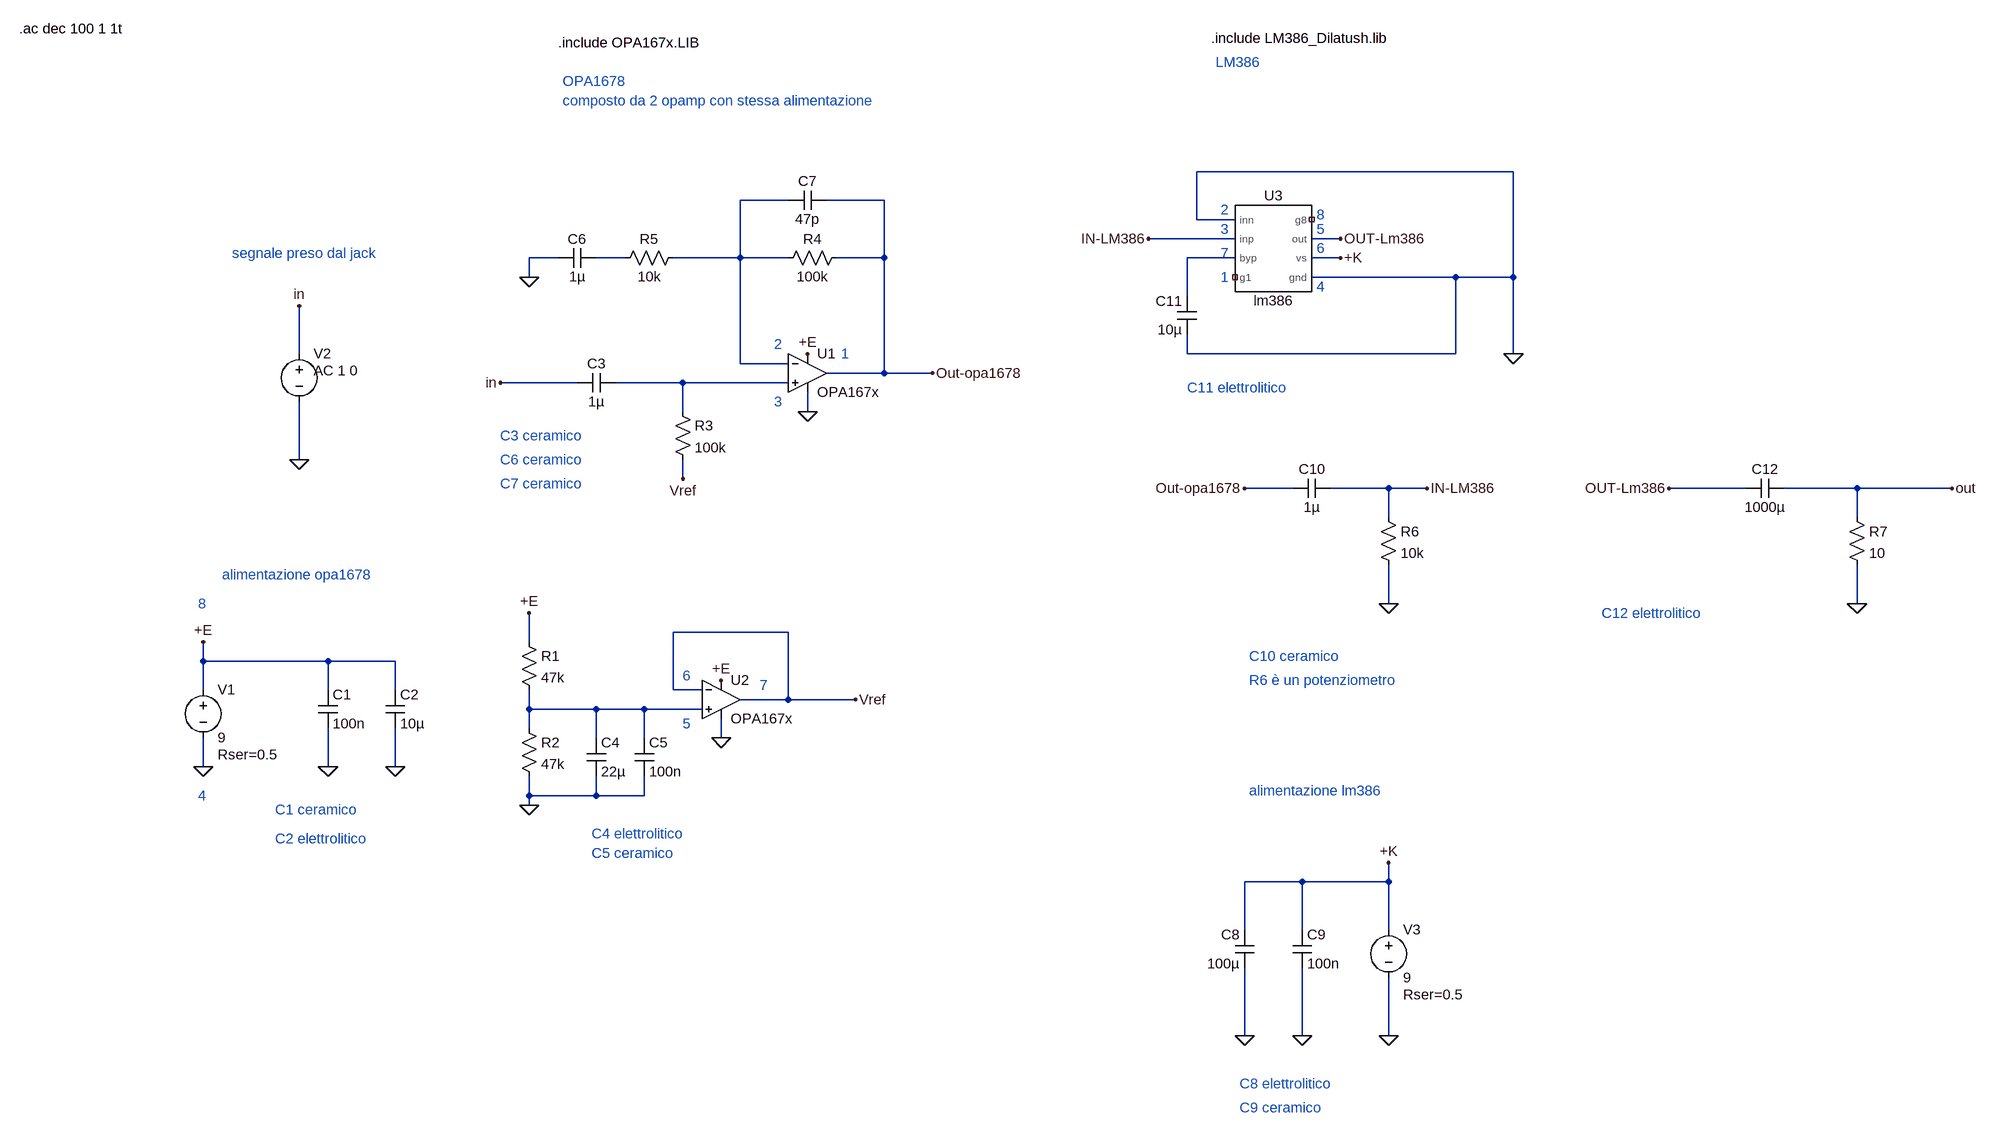
[diagram p0: schematic Test-schematico.asc]
Test-schematico.asc, the LTspice schematic file:
Version 4.1
SHEET 1 2776 920
WIRE 1648 -656 1120 -656
WIRE 48 -608 -32 -608
WIRE 208 -608 112 -608
WIRE 1120 -576 1120 -656
WIRE 1184 -576 1120 -576
WIRE 1184 -544 1040 -544
WIRE 1360 -544 1312 -544
WIRE -336 -512 -384 -512
WIRE -224 -512 -272 -512
WIRE -32 -512 -32 -608
WIRE -32 -512 -144 -512
WIRE 48 -512 -32 -512
WIRE 208 -512 208 -608
WIRE 208 -512 128 -512
WIRE 1184 -512 1104 -512
WIRE 1360 -512 1312 -512
WIRE -384 -480 -384 -512
WIRE 1552 -480 1312 -480
WIRE 1648 -480 1648 -656
WIRE 1648 -480 1552 -480
WIRE 1104 -448 1104 -512
WIRE -1024 -352 -1024 -432
WIRE 1104 -352 1104 -384
WIRE 1552 -352 1552 -480
WIRE 1552 -352 1104 -352
WIRE 1648 -352 1648 -480
WIRE -32 -336 -32 -512
WIRE 48 -336 -32 -336
WIRE 208 -320 208 -512
WIRE 208 -320 112 -320
WIRE 288 -320 208 -320
WIRE -304 -304 -432 -304
WIRE -128 -304 -240 -304
WIRE 48 -304 -128 -304
WIRE -128 -256 -128 -304
WIRE 80 -256 80 -288
WIRE -1024 -176 -1024 -272
WIRE -128 -144 -128 -176
WIRE 1280 -128 1200 -128
WIRE 1440 -128 1344 -128
WIRE 1504 -128 1440 -128
WIRE 2112 -128 1984 -128
WIRE 2304 -128 2176 -128
WIRE 2464 -128 2304 -128
WIRE 1440 -80 1440 -128
WIRE 2304 -80 2304 -128
WIRE 1440 64 1440 0
WIRE 2304 64 2304 0
WIRE 48 112 -144 112
WIRE -384 128 -384 80
WIRE -1184 160 -1184 128
WIRE -976 160 -1184 160
WIRE -864 160 -976 160
WIRE -1184 208 -1184 160
WIRE -976 208 -976 160
WIRE -864 208 -864 160
WIRE -144 208 -144 112
WIRE -96 208 -144 208
WIRE 48 224 48 112
WIRE 48 224 -32 224
WIRE 160 224 48 224
WIRE -384 240 -384 208
WIRE -272 240 -384 240
WIRE -192 240 -272 240
WIRE -96 240 -192 240
WIRE -384 272 -384 240
WIRE -272 288 -272 240
WIRE -192 288 -192 240
WIRE -64 288 -64 256
WIRE -1184 336 -1184 288
WIRE -976 336 -976 272
WIRE -864 336 -864 272
WIRE -384 384 -384 352
WIRE -272 384 -272 352
WIRE -272 384 -384 384
WIRE -192 384 -192 352
WIRE -192 384 -272 384
WIRE -384 400 -384 384
WIRE 1296 528 1200 528
WIRE 1440 528 1440 496
WIRE 1440 528 1296 528
WIRE 1200 608 1200 528
WIRE 1296 608 1296 528
WIRE 1440 608 1440 528
WIRE 1200 784 1200 672
WIRE 1296 784 1296 672
WIRE 1440 784 1440 688
FLAG -1184 336 0
FLAG -1184 128 +E
FLAG 80 -256 0
FLAG -64 288 0
FLAG -976 336 0
FLAG -864 336 0
FLAG -64 192 +E
FLAG 80 -352 +E
FLAG 160 224 Vref
FLAG -128 -144 Vref
FLAG -384 400 0
FLAG -384 80 +E
FLAG -1024 -176 0
FLAG -1024 -432 in
FLAG -384 -480 0
FLAG 288 -320 Out-opa1678
FLAG -432 -304 in
FLAG 1440 784 0
FLAG 1200 784 0
FLAG 1296 784 0
FLAG 1440 496 +K
FLAG 1440 64 0
FLAG 1200 -128 Out-opa1678
FLAG 1504 -128 IN-LM386
FLAG 1040 -544 IN-LM386
FLAG 1648 -352 0
FLAG 1360 -544 OUT-Lm386
FLAG 1360 -512 +K
FLAG 2304 64 0
FLAG 1984 -128 OUT-Lm386
FLAG 2464 -128 out
SYMBOL OpAmps\\opamp2 80 -384 R0
SYMATTR InstName U1
SYMATTR Value OPA167x
SYMBOL OpAmps\\opamp2 -64 160 R0
SYMATTR InstName U2
SYMATTR Value OPA167x
SYMBOL voltage -1184 192 R0
WINDOW 123 0 0 Left 0
WINDOW 39 24 124 Left 2
SYMATTR SpiceLine Rser=0.5
SYMATTR InstName V1
SYMATTR Value 9
SYMBOL cap -992 208 R0
SYMATTR InstName C1
SYMATTR Value 100n
SYMATTR SpiceLine V=50 Irms=20.8m Rser=5.448 Lser=0
SYMBOL cap -880 208 R0
SYMATTR Value 10µ
SYMATTR InstName C2
SYMATTR SpiceLine V=16 Irms=0 Rser=2.8 Lser=0 mfg="AVX" pn="TAJC106M016" type="Tantalum"
SYMBOL res -144 -272 R0
SYMATTR InstName R3
SYMATTR Value 100k
SYMBOL res -400 112 R0
SYMATTR InstName R1
SYMATTR Value 47k
SYMBOL res -400 256 R0
SYMATTR InstName R2
SYMATTR Value 47k
SYMBOL cap -288 288 R0
SYMATTR InstName C4
SYMATTR Value 22µ
SYMBOL cap -208 288 R0
SYMATTR InstName C5
SYMATTR Value 100n
SYMBOL voltage -1024 -368 R0
WINDOW 123 24 44 Left 2
WINDOW 39 0 0 Left 0
SYMATTR Value2 AC 1 0
SYMATTR InstName V2
SYMATTR Value ""
SYMBOL cap -240 -320 R90
WINDOW 0 0 32 VBottom 2
WINDOW 3 32 32 VTop 2
SYMATTR InstName C3
SYMATTR Value 1µ
SYMBOL res 144 -528 R90
WINDOW 0 0 56 VBottom 2
WINDOW 3 32 56 VTop 2
SYMATTR InstName R4
SYMATTR Value 100k
SYMBOL cap 112 -624 R90
WINDOW 0 0 32 VBottom 2
WINDOW 3 32 32 VTop 2
SYMATTR InstName C7
SYMATTR Value 47p
SYMBOL res -128 -528 R90
WINDOW 0 0 56 VBottom 2
WINDOW 3 32 56 VTop 2
SYMATTR InstName R5
SYMATTR Value 10k
SYMBOL cap -272 -528 R90
WINDOW 0 0 32 VBottom 2
WINDOW 3 32 32 VTop 2
SYMATTR InstName C6
SYMATTR Value 1µ
SYMBOL lm386 1248 -528 R0
SYMATTR InstName U3
SYMBOL cap 1216 672 R180
WINDOW 0 24 56 Left 2
WINDOW 3 24 8 Left 2
SYMATTR InstName C8
SYMATTR Value 100µ
SYMBOL cap 1280 608 R0
SYMATTR InstName C9
SYMATTR Value 100n
SYMBOL voltage 1440 592 R0
WINDOW 123 0 0 Left 0
WINDOW 39 24 124 Left 2
SYMATTR SpiceLine Rser=0.5
SYMATTR InstName V3
SYMATTR Value 9
SYMBOL cap 1344 -144 R90
WINDOW 0 0 32 VBottom 2
WINDOW 3 32 32 VTop 2
SYMATTR InstName C10
SYMATTR Value 1µ
SYMBOL res 1424 -96 R0
SYMATTR InstName R6
SYMATTR Value 10k
SYMBOL cap 1120 -384 R180
WINDOW 0 24 56 Left 2
WINDOW 3 24 8 Left 2
SYMATTR InstName C11
SYMATTR Value 10µ
SYMBOL cap 2176 -144 R90
WINDOW 0 0 32 VBottom 2
WINDOW 3 32 32 VTop 2
SYMATTR InstName C12
SYMATTR Value 1000µ
SYMBOL res 2288 -96 R0
SYMATTR InstName R7
SYMATTR Value 10
TEXT -336 -912 Left 2 !.include OPA167x.LIB
TEXT -328 -848 Left 2 ;OPA1678
TEXT -328 -816 Left 2 ;composto da 2 opamp con stessa alimentazione
TEXT 136 -352 Left 2 ;1
TEXT 24 -368 Left 2 ;2
TEXT 24 -272 Left 2 ;3
TEXT 0 200 Left 2 ;7
TEXT -128 184 Left 2 ;6
TEXT -128 264 Left 2 ;5
TEXT -1192 64 Left 2 ;8
TEXT -1192 384 Left 2 ;4
TEXT -280 448 Left 2 ;C4 elettrolitico
TEXT -280 480 Left 2 ;C5 ceramico
TEXT -1136 -520 Left 2 ;segnale preso dal jack
TEXT -1152 16 Left 2 ;alimentazione opa1678
TEXT -432 -216 Left 2 ;C3 ceramico
TEXT -432 -176 Left 2 ;C6 ceramico
TEXT -432 -136 Left 2 ;C7 ceramico
TEXT -1584 -936 Left 2 !.ac dec 100 1 1t
TEXT 1144 -920 Left 2 !.include LM386_Dilatush.lib
TEXT 1208 376 Left 2 ;alimentazione lm386
TEXT -1064 456 Left 2 ;C2 elettrolitico
TEXT -1064 408 Left 2 ;C1 ceramico
TEXT 1192 864 Left 2 ;C8 elettrolitico
TEXT 1192 904 Left 2 ;C9 ceramico
TEXT 1208 152 Left 2 ;C10 ceramico
TEXT 1152 -880 Left 2 ;LM386
TEXT 1104 -296 Left 2 ;C11 elettrolitico
TEXT 1872 80 Left 2 ;C12 elettrolitico
TEXT 1208 192 Left 2 ;R6 è un potenziometro
TEXT 1160 -480 Left 2 ;1
TEXT 1160 -592 Left 2 ;2
TEXT 1160 -560 Left 2 ;3
TEXT 1320 -464 Left 2 ;4
TEXT 1320 -560 Left 2 ;5
TEXT 1320 -528 Left 2 ;6
TEXT 1160 -520 Left 2 ;7
TEXT 1320 -584 Left 2 ;8

The netlist it stands for:
* Test-schematico.asc
X§U1 N004 N001 +E 0 Out-opa1678 OPA167x  ; pins In+ In- V+ V- OUT
X§U2 N005 Vref +E 0 Vref OPA167x  ; pins In+ In- V+ V- OUT
V1 +E 0 9 Rser=0.5
C1 +E 0 100n V=50 Irms=20.8m Rser=5.448 Lser=0
C2 +E 0 10µ V=16 Irms=0 Rser=2.8 Lser=0 mfg="AVX" pn="TAJC106M016" type="Tantalum"
R3 N004 Vref 100k
R1 +E N005 47k
R2 N005 0 47k
C4 N005 0 22µ
C5 N005 0 100n
V2 in 0 AC 1 0
C3 N004 in 1µ
R4 Out-opa1678 N001 100k
C7 Out-opa1678 N001 47p
R5 N001 N002 10k
C6 N002 0 1µ
X§U3 0 IN-LM386 N003 NC_01 NC_02 OUT-Lm386 +K 0 lm386  ; pins inn inp byp g1 g8 out vs gnd
C8 0 +K 100µ
C9 +K 0 100n
V3 +K 0 9 Rser=0.5
C10 IN-LM386 Out-opa1678 1µ
R6 IN-LM386 0 10k
C11 0 N003 10µ
C12 out OUT-Lm386 1000µ
R7 out 0 10
.include OPA167x.LIB
* OPA1678
* composto da 2 opamp con stessa alimentazione
* 1
* 2
* 3
* 7
* 6
* 5
* 8
* 4
* C4 elettrolitico
* C5 ceramico
* segnale preso dal jack
* alimentazione opa1678
* C3 ceramico
* C6 ceramico
* C7 ceramico
.ac dec 100 1 1t
.include LM386_Dilatush.lib
* alimentazione lm386
* C2 elettrolitico
* C1 ceramico
* C8 elettrolitico
* C9 ceramico
* C10 ceramico
* LM386
* C11 elettrolitico
* C12 elettrolitico
* R6 è un potenziometro
* 1
* 2
* 3
* 4
* 5
* 6
* 7
* 8
.lib LM386_Dilatush.lib
.backanno
.end